# EAGLE schematic pc (EAGLE 9.6.2)
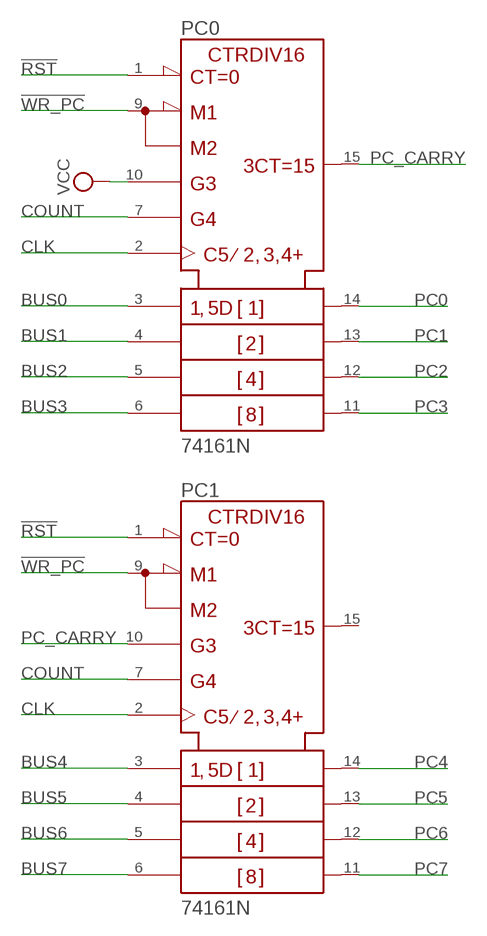
[diagram p0: schematic, sheet 1]

## Parts
PC0  74161N  [DIL16]
PC1  74161N  [DIL16]

## Nets
!RST: PC0.1(!CLR) PC1.1(!CLR)
!WR_PC: PC0.9(!LOAD) PC1.9(!LOAD)
BUS0: PC0.3(A)
BUS1: PC0.4(B)
BUS2: PC0.5(C)
BUS3: PC0.6(D)
BUS4: PC1.3(A)
BUS5: PC1.4(B)
BUS6: PC1.5(C)
BUS7: PC1.6(D)
CLK: PC0.2(CLK) PC1.2(CLK)
COUNT: PC0.7(ENP) PC1.7(ENP)
PC0: PC0.14(QA)
PC1: PC0.13(QB)
PC2: PC0.12(QC)
PC3: PC0.11(QD)
PC4: PC1.14(QA)
PC5: PC1.13(QB)
PC6: PC1.12(QC)
PC7: PC1.11(QD)
PC_CARRY: PC0.15(RCO) PC1.10(ENT)
VCC: PC0.10(ENT)
Unconnected: PC1.15(RCO)

## Power pins joined to a net without a drawn wire
+UB: PC0.16(+UB) PC1.16(+UB)
-UB: PC0.8(-UB) PC1.8(-UB)

## Library data of the parts
PC0 PC1 = 74ttl-din:74*161: Synchrounus 4-bit COUNTER